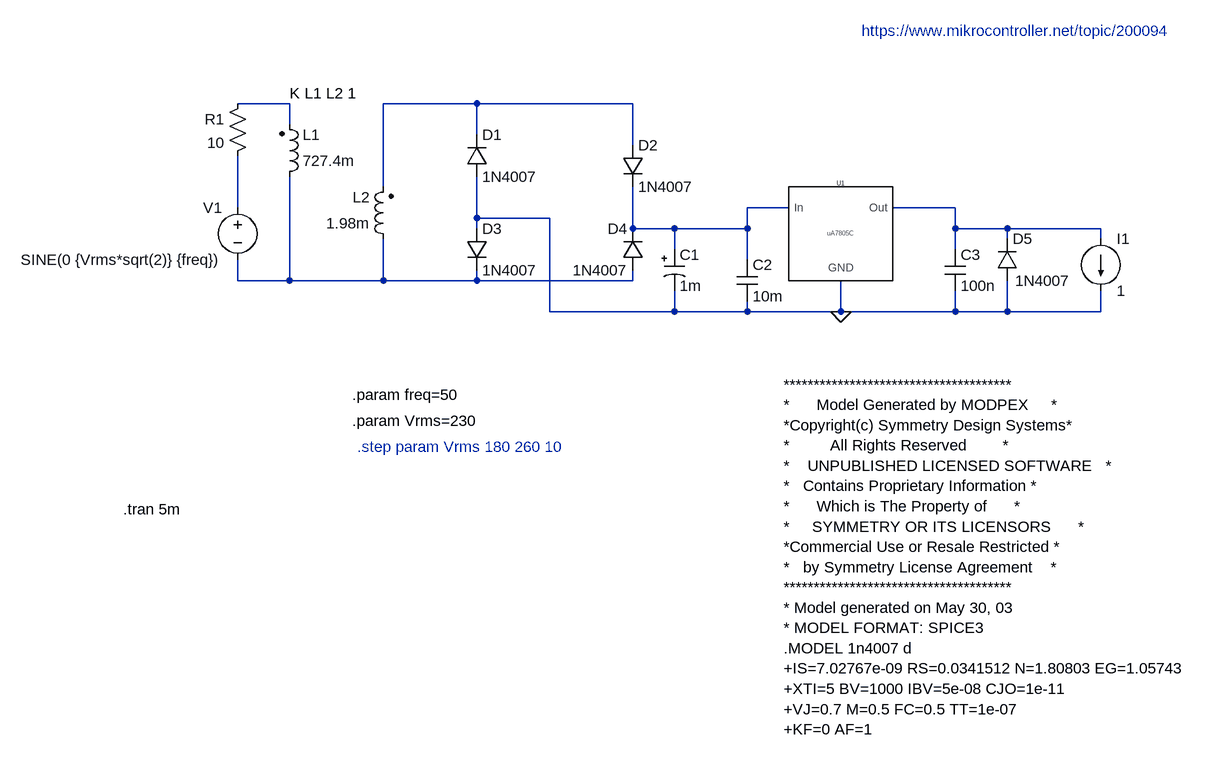
[diagram p0: schematic Draft34.asc]
Draft34.asc, the LTspice schematic file:
Version 4
SHEET 1 2144 680
WIRE -160 -400 -240 -400
WIRE 128 -400 -16 -400
WIRE 368 -400 128 -400
WIRE -160 -368 -160 -400
WIRE 128 -352 128 -400
WIRE 368 -336 368 -400
WIRE -16 -272 -16 -400
WIRE -240 -240 -240 -320
WIRE 608 -240 544 -240
WIRE 864 -240 768 -240
WIRE 128 -224 128 -288
WIRE 240 -224 128 -224
WIRE 128 -208 128 -224
WIRE 368 -208 368 -272
WIRE 432 -208 368 -208
WIRE 544 -208 544 -240
WIRE 544 -208 432 -208
WIRE 864 -208 864 -240
WIRE 944 -208 864 -208
WIRE 1088 -208 944 -208
WIRE 368 -192 368 -208
WIRE 944 -192 944 -208
WIRE 1088 -192 1088 -208
WIRE 432 -176 432 -208
WIRE 864 -176 864 -208
WIRE 544 -160 544 -208
WIRE -240 -128 -240 -160
WIRE -160 -128 -160 -288
WIRE -160 -128 -240 -128
WIRE -16 -128 -16 -192
WIRE -16 -128 -160 -128
WIRE 128 -128 128 -144
WIRE 128 -128 -16 -128
WIRE 368 -128 368 -144
WIRE 368 -128 128 -128
WIRE 240 -80 240 -224
WIRE 432 -80 432 -112
WIRE 432 -80 240 -80
WIRE 544 -80 544 -96
WIRE 544 -80 432 -80
WIRE 688 -80 688 -128
WIRE 688 -80 544 -80
WIRE 864 -80 864 -112
WIRE 864 -80 688 -80
WIRE 944 -80 944 -128
WIRE 944 -80 864 -80
WIRE 1088 -80 1088 -112
WIRE 1088 -80 944 -80
FLAG 688 -80 0
DATAFLAG 400 -80 ""
SYMBOL ind2 -176 -272 M180
WINDOW 0 36 80 Left 2
WINDOW 3 36 40 Left 2
SYMATTR InstName L1
SYMATTR Value 727.4m
SYMBOL ind2 0 -176 R180
WINDOW 0 36 80 Left 2
WINDOW 3 36 40 Left 2
SYMATTR InstName L2
SYMATTR Value 1.98m
SYMBOL LM7805 688 -208 R0
SYMATTR InstName U1
SYMBOL cap 848 -176 R0
SYMATTR InstName C3
SYMATTR Value 100n
SYMBOL diode 928 -128 M180
WINDOW 0 24 64 Left 2
WINDOW 3 113 0 Right 2
SYMATTR InstName D5
SYMATTR Value 1N4007
SYMBOL cap 528 -160 R0
SYMATTR InstName C2
SYMATTR Value 10m
SYMBOL polcap 416 -176 R0
SYMATTR InstName C1
SYMATTR Value 1m
SYMBOL diode 352 -336 R0
SYMATTR InstName D2
SYMATTR Value 1N4007
SYMBOL diode 384 -144 R180
WINDOW 0 24 64 Left 2
WINDOW 3 24 0 Left 2
SYMATTR InstName D4
SYMATTR Value 1N4007
SYMBOL diode 112 -208 R0
SYMATTR InstName D3
SYMATTR Value 1N4007
SYMBOL diode 112 -288 M180
WINDOW 0 24 64 Left 2
WINDOW 3 24 0 Left 2
SYMATTR InstName D1
SYMATTR Value 1N4007
SYMBOL voltage -240 -256 M0
WINDOW 123 0 0 Left 0
WINDOW 39 0 0 Left 0
SYMATTR InstName V1
SYMATTR Value SINE(0 {Vrms*sqrt(2)} {freq})
SYMBOL res -224 -416 M0
SYMATTR InstName R1
SYMATTR Value 10
SYMBOL load2 1088 -192 R0
WINDOW 123 0 0 Left 0
WINDOW 39 0 0 Left 0
SYMATTR InstName I1
SYMATTR Value 1
TEXT -160 -416 Left 2 !K L1 L2 1
TEXT -416 224 Left 2 !.tran 5m
TEXT 720 -512 Left 2 ;https://www.mikrocontroller.net/topic/200094
TEXT 600 32 Left 2 !**************************************\n*      Model Generated by MODPEX     *\n*Copyright(c) Symmetry Design Systems*\n*         All Rights Reserved        *\n*    UNPUBLISHED LICENSED SOFTWARE   *\n*   Contains Proprietary Information *\n*      Which is The Property of      *\n*     SYMMETRY OR ITS LICENSORS      *\n*Commercial Use or Resale Restricted *\n*   by Symmetry License Agreement    *\n**************************************\n* Model generated on May 30, 03\n* MODEL FORMAT: SPICE3\n.MODEL 1n4007 d\n+IS=7.02767e-09 RS=0.0341512 N=1.80803 EG=1.05743\n+XTI=5 BV=1000 IBV=5e-08 CJO=1e-11\n+VJ=0.7 M=0.5 FC=0.5 TT=1e-07\n+KF=0 AF=1
TEXT -64 88 Left 2 !.param Vrms=230
TEXT -64 48 Left 2 !.param freq=50
TEXT -56 128 Left 2 ;.step param Vrms 180 260 10

The netlist it stands for:
* Draft34.asc
L1 N006 N001 727.4m
L2 N006 N002 1.98m
XU1 N004 N005 0 7805  ; pins In Out GND
C3 N005 0 100n
D5 0 N005 1N4007
C2 N004 0 10m
C1 N004 0 1m
D2 N002 N004 1N4007
D4 N006 N004 1N4007
D3 0 N006 1N4007
D1 0 N002 1N4007
V1 N003 N006 SINE(0 {Vrms*sqrt(2)} {freq})
R1 N001 N003 10
I1 N005 0 1
.model D D
.lib standard.dio
K L1 L2 1
.tran 5m
* https://www.mikrocontroller.net/topic/200094
**************************************
*      Model Generated by MODPEX     *
*Copyright(c) Symmetry Design Systems*
*         All Rights Reserved        *
*    UNPUBLISHED LICENSED SOFTWARE   *
*   Contains Proprietary Information *
*      Which is The Property of      *
*     SYMMETRY OR ITS LICENSORS      *
*Commercial Use or Resale Restricted *
*   by Symmetry License Agreement    *
**************************************
* Model generated on May 30, 03
* MODEL FORMAT: SPICE3
.MODEL 1n4007 d
+IS=7.02767e-09 RS=0.0341512 N=1.80803 EG=1.05743
+XTI=5 BV=1000 IBV=5e-08 CJO=1e-11
+VJ=0.7 M=0.5 FC=0.5 TT=1e-07
+KF=0 AF=1
.param Vrms=230
.param freq=50
* .step param Vrms 180 260 10
.lib 78xx.lib
.backanno
.end